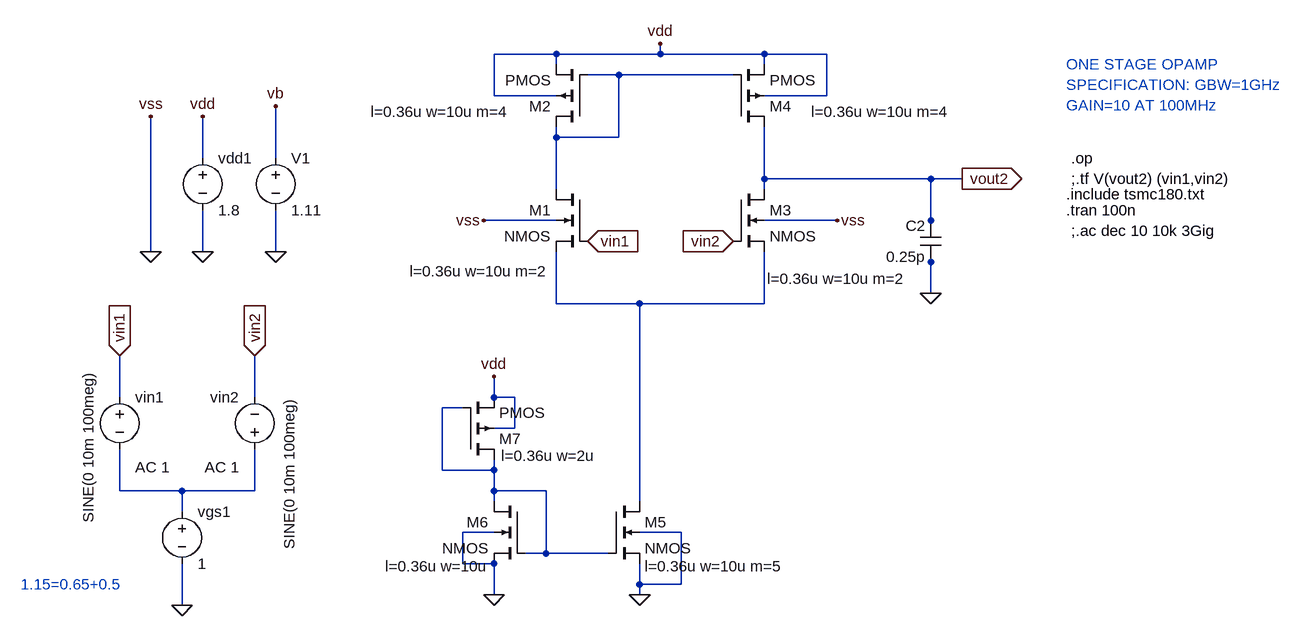
[diagram p0: schematic Single Stage Opamp for 1GHZ.asc]
Single Stage Opamp for 1GHZ.asc, the LTspice schematic file:
Version 4
SHEET 1 1716 1124
WIRE 576 256 480 256
WIRE 736 256 736 240
WIRE 736 256 576 256
WIRE 896 256 736 256
WIRE 992 256 896 256
WIRE 576 272 576 256
WIRE 896 272 896 256
WIRE 672 288 624 288
WIRE 848 288 672 288
WIRE 480 320 480 256
WIRE 576 320 480 320
WIRE 992 320 992 256
WIRE 992 320 896 320
WIRE 576 384 576 368
WIRE 672 384 672 288
WIRE 672 384 576 384
WIRE 32 416 32 352
WIRE 144 416 144 336
WIRE 896 448 896 368
WIRE 1152 448 896 448
WIRE 1200 448 1152 448
WIRE 576 464 576 384
WIRE 896 464 896 448
WIRE 576 512 464 512
WIRE 1008 512 896 512
WIRE 1152 512 1152 448
WIRE 1152 528 1152 512
WIRE -48 560 -48 352
WIRE 32 560 32 496
WIRE 144 560 144 496
WIRE 1152 576 1152 560
WIRE 1152 624 1152 576
WIRE 576 640 576 560
WIRE 704 640 576 640
WIRE 896 640 896 560
WIRE 896 640 704 640
WIRE -96 784 -96 720
WIRE 112 784 112 720
WIRE 480 784 480 752
WIRE 512 784 480 784
WIRE 432 800 400 800
WIRE 512 832 512 784
WIRE 512 832 480 832
WIRE 400 896 400 800
WIRE 480 896 480 880
WIRE 480 896 400 896
WIRE -96 928 -96 864
WIRE 0 928 -96 928
WIRE 112 928 112 864
WIRE 112 928 0 928
WIRE 480 928 480 896
WIRE 560 928 480 928
WIRE 480 944 480 928
WIRE 704 944 704 640
WIRE 0 960 0 928
WIRE 480 992 432 992
WIRE 768 992 704 992
WIRE 560 1024 560 928
WIRE 560 1024 528 1024
WIRE 656 1024 560 1024
WIRE 432 1040 432 992
WIRE 480 1040 432 1040
WIRE 704 1072 704 1040
WIRE 768 1072 768 992
WIRE 768 1072 704 1072
WIRE 480 1088 480 1040
WIRE 704 1088 704 1072
WIRE 0 1104 0 1040
FLAG 464 512 vss
FLAG 848 544 vin2
IOPIN 848 544 In
FLAG 736 240 vdd
FLAG 1008 512 vss
FLAG 624 544 vin1
IOPIN 624 544 In
FLAG 1200 448 vout2
IOPIN 1200 448 Out
FLAG 1152 624 0
FLAG 0 1104 0
FLAG 32 560 0
FLAG -48 560 0
FLAG -48 352 vss
FLAG 32 352 vdd
FLAG 144 560 0
FLAG 144 336 vb
FLAG -96 720 vin1
IOPIN -96 720 In
FLAG 112 720 vin2
IOPIN 112 720 In
FLAG 704 1088 0
FLAG 480 1088 0
FLAG 480 752 vdd
DATAFLAG 1152 448 ""
DATAFLAG 576 416 ""
DATAFLAG 576 416 ""
SYMBOL nmos4 624 464 M0
WINDOW 123 60 126 Left 2
SYMATTR Value2 l=0.36u w=10u m=2
SYMATTR InstName M1
SYMBOL pmos4 624 368 R180
WINDOW 123 120 23 Left 2
SYMATTR Value2 l=0.36u w=10u m=4
SYMATTR InstName M2
SYMBOL nmos4 848 464 R0
WINDOW 123 52 138 Left 2
SYMATTR Value2 l=0.36u w=10u m=2
SYMATTR InstName M3
SYMBOL cap 1168 512 M0
SYMATTR InstName C2
SYMATTR Value 0.25p
SYMBOL pmos4 848 368 M180
WINDOW 123 120 23 Left 2
SYMATTR Value2 l=0.36u w=10u m=4
SYMATTR InstName M4
SYMBOL voltage 0 944 R0
WINDOW 123 0 0 Left 0
WINDOW 39 0 0 Left 0
SYMATTR InstName vgs1
SYMATTR Value 1
SYMBOL voltage -96 768 R0
WINDOW 3 -48 -25 VRight 2
WINDOW 123 24 124 Left 2
WINDOW 39 0 0 Left 0
SYMATTR Value SINE(0 10m 100meg)
SYMATTR Value2 AC 1
SYMATTR InstName vin1
SYMBOL voltage 112 880 R180
WINDOW 0 24 96 Left 2
WINDOW 3 -53 -138 VRight 2
WINDOW 123 24 -12 Left 2
WINDOW 39 0 0 Left 0
SYMATTR InstName vin2
SYMATTR Value SINE(0 10m 100meg)
SYMATTR Value2 AC 1
SYMBOL voltage 32 400 R0
WINDOW 123 0 0 Left 0
WINDOW 39 0 0 Left 0
SYMATTR InstName vdd1
SYMATTR Value 1.8
SYMBOL voltage 144 400 R0
WINDOW 123 0 0 Left 0
WINDOW 39 0 0 Left 0
SYMATTR InstName V1
SYMATTR Value 1.11
SYMBOL nmos4 528 944 M0
WINDOW 123 56 100 Left 2
SYMATTR Value2 l=0.36u w=10u
SYMATTR InstName M6
SYMBOL pmos4 432 880 M180
WINDOW 123 59 6 Left 2
SYMATTR Value2 l=0.36u w=2u
SYMATTR InstName M7
SYMBOL nmos4 656 944 R0
WINDOW 123 56 100 Left 2
SYMATTR Value2 l=0.36u w=10u m=5
SYMATTR InstName M5
TEXT 1360 472 Left 2 !.include tsmc180.txt
TEXT 1368 416 Left 2 !.op
TEXT 1360 496 Left 2 !.tran 100n
TEXT 1368 528 Left 2 !;.ac dec 10 10k 3Gig
TEXT 1368 448 Left 2 !;.tf V(vout2) (vin1,vin2)
TEXT 1360 272 Left 2 ;ONE STAGE OPAMP\nSPECIFICATION: GBW=1GHz  \nGAIN=10 AT 100MHz
TEXT -248 1072 Left 2 ;1.15=0.65+0.5

The netlist it stands for:
* Single Stage Opamp for 1GHZ.asc
M1 N001 vin1 N002 0 NMOS l=0.36u w=10u m=2
M2 N001 N001 vdd vdd PMOS l=0.36u w=10u m=4
M3 vout2 vin2 N002 0 NMOS l=0.36u w=10u m=2
C2 vout2 0 0.25p
M4 vout2 N001 vdd vdd PMOS l=0.36u w=10u m=4
vgs1 N004 0 1
vin1 vin1 N004 SINE(0 10m 100meg) AC 1
vin2 N004 vin2 SINE(0 10m 100meg) AC 1
vdd1 vdd 0 1.8
V1 vb 0 1.11
M6 N003 N003 0 0 NMOS l=0.36u w=10u
M7 N003 N003 vdd vdd PMOS l=0.36u w=2u
M5 N002 N003 0 0 NMOS l=0.36u w=10u m=5
.model NMOS NMOS
.model PMOS PMOS
.lib standard.mos
.include tsmc180.txt
.op
.tran 100n
;.ac dec 10 10k 3Gig
;.tf V(vout2) (vin1,vin2)
* ONE STAGE OPAMP
* SPECIFICATION: GBW=1GHz
* GAIN=10 AT 100MHz
* 1.15=0.65+0.5
.backanno
.end